# Altium schematic sheet 调焦器.SchDoc
size A4
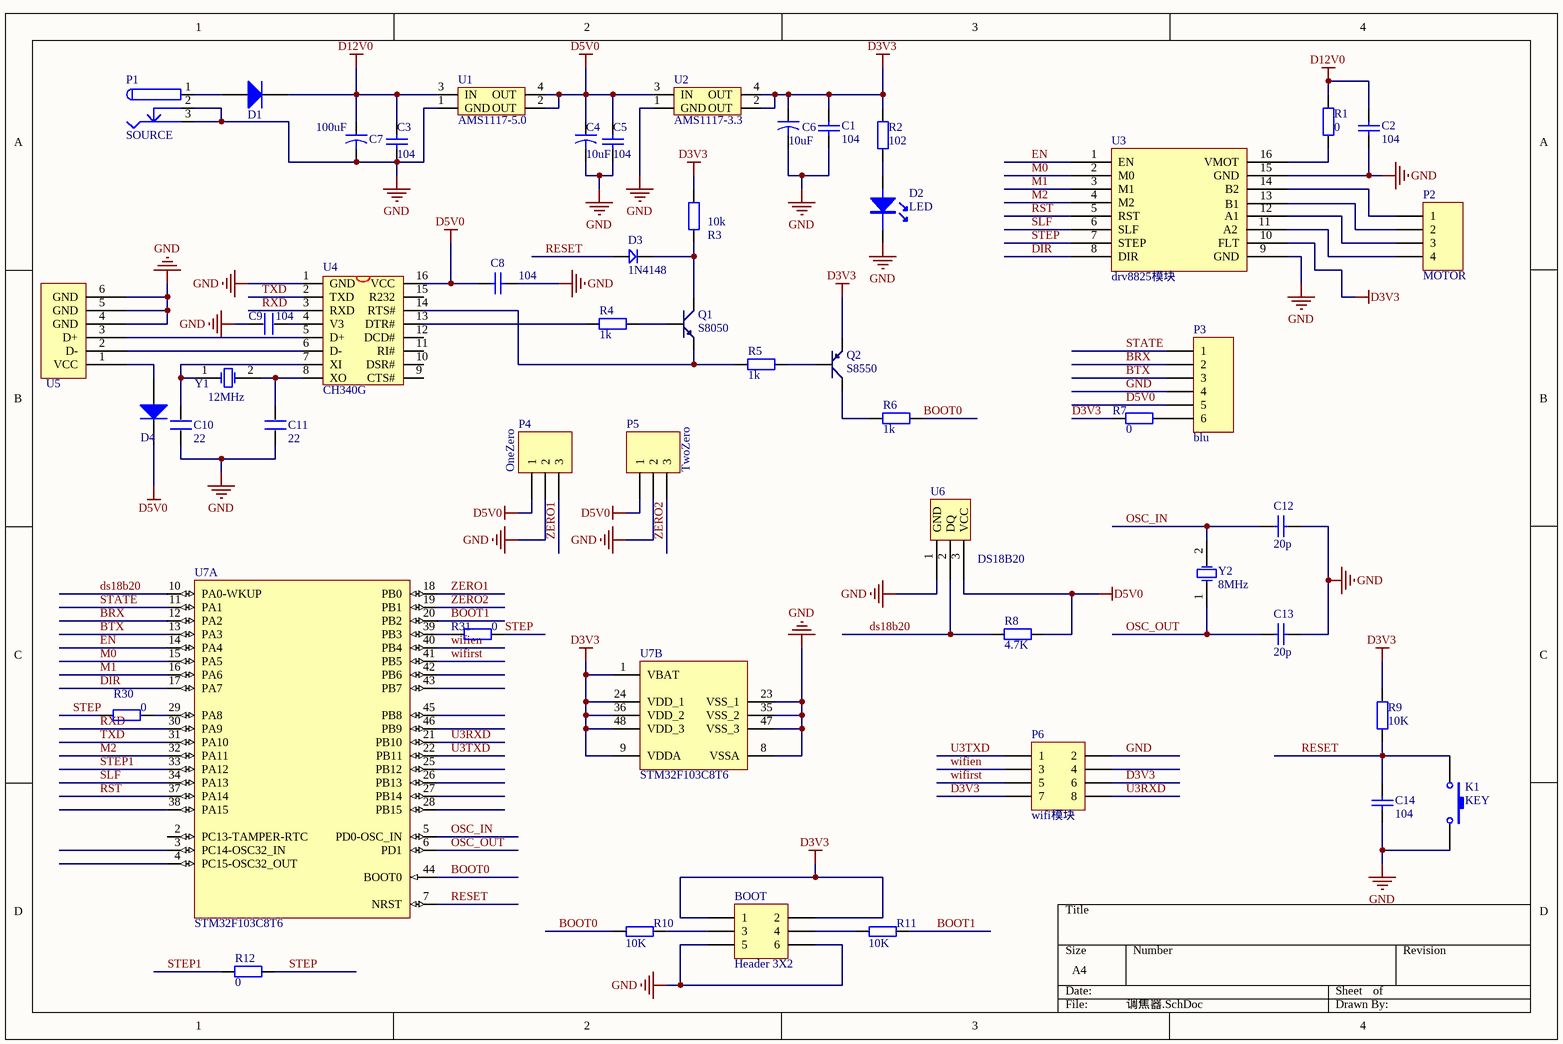
[diagram p0: 调焦器.SchDoc]

## Parts
BOOT  Header 3X2  [HDR2X3]
C1  value 104  [0805_cap]  (hidden comment: Cap)
C2  value 104  [0805_cap]  (hidden comment: Cap)
C3  value 104  [0805_cap]  (hidden comment: Cap)
C4  vaule: 10uF  [1812]  (hidden comment: CAP)
C5  value 104  [0805_cap]  (hidden comment: Cap)
C6  vaule: 10uF  [1812]  (hidden comment: CAP)
C7  vaule: 100uF  [1000UF/16V]  (hidden comment: CAP)
C8  value 104  [0805_cap]  (hidden comment: Cap)
C9  104  [0805]
C10  22  [0805]
C11  22  [0805]
C12  value 20p  [0805_cap]  (hidden comment: Cap)
C13  value 20p  [0805_cap]  (hidden comment: Cap)
C14  value 104  [0805_cap]  (hidden comment: Cap)
D1  Diode  [Diode]  (value not drawn)
D2  LED  [LED]
D3  1N4148  [Diode]
D4  Diode  [Diode]  (value not drawn)
K1  KEY  [KEY2]
P1  SOURCE  [source]
P2  MOTOR  [HDR1X4]
P3  blu  [HDR1X6]
P4  OneZero  [HDR1X3]
P5  TwoZero  [HDR1X3]
P6  wifi模块  [HDR2X4]
Q1  S8050  [SOT-23R]
Q2  S8550  [SOT-23R]
R1  0  [0805]
R2  102  [0805]
R3  10k  [0805]
R4  1k  [0805]
R5  1k  [0805]
R6  1k  [0805]
R7  0  [0805]
R8  4.7K  [0805]
R9  10K  [0805]
R10  10K  [0805]
R11  10K  [0805]
R12  0  [0805]
R30  0  [0805]
R31  0  [0805]
U1  AMS1117-5.0  [AMS1117]
U2  AMS1117-3.3  [AMS1117]
U3  drv8825模块  [DRV8825模块 - duplicate]
U4  CH340G  [SOP16M]
U5  USB-B  [USB_B]  (value not drawn)
U6  DS18B20  [DS18B20]
U7  STM32F103C8T6  [LQFP48_N]  (parts A,B of 2)
Y1  12MHz  [XTAL_US]
Y2  8MHz  [XTAL_US]

## Nets
D3V3: BOOT.1 BOOT.2 C1.2 C6.1 P6.6 P6.7 Q2.1(E) R2.2 R3.2 R7.1 R9.2 U2.2(OUT) U2.4(OUT) U3.10(FLT) U7.1(VBAT) U7.9(VDDA) U7.24(VDD_1) U7.36(VDD_2) U7.48(VDD_3)
D5V0: C4.1 C5.2 C8.2 D4.2(K) P3.5 P4.1 P5.1 R8.2 U1.2(OUT) U1.4(OUT) U2.3(IN) U4.16(VCC) U6.3(VCC)
D12V0: C2.2 C3.2 C7.1 D1.2(K) R1.2 U1.3(IN)
GND: BOOT.5 BOOT.6 C1.1 C2.1 C3.1 C4.2 C5.1 C6.2 C7.2 C8.1 C9.1 C10.1 C11.1 C12.2 C13.2 C14.1 D2.2(K) K1.2 P1.2 P1.3 P3.4 P4.2 P5.2 P6.2 U1.1(GND) U2.1(GND) U3.9(GND) U3.15(GND) U4.1(GND) U5.4(GND) U5.5(GND) U5.6(GND) U6.1(GND) U7.8(VSSA) U7.23(VSS_1) U7.35(VSS_2) U7.47(VSS_3)
BOOT0: R6.2 R10.1 U7.44(BOOT0)
BOOT1: R11.2 U7.20(PB2)
BRX: P3.2 U7.12(PA2)
BTX: P3.3 U7.13(PA3)
DIR: U3.8(DIR) U7.17(PA7)
ds18b20: R8.1 U6.2(DQ) U7.10(PA0-WKUP)
EN: U3.1(EN) U7.14(PA4)
M0: U3.2(M0) U7.15(PA5)
M1: U3.3(M1) U7.16(PA6)
M2: U3.4(M2) U7.32(PA11)
OSC_IN: C12.1 U7.5(PD0-OSC_IN) Y2.2(OSC2)
OSC_OUT: C13.1 U7.6(PD1) Y2.1(OSC1)
RESET: C14.2 D3.1 K1.1 R9.1 U7.7(NRST)
RST: U3.5(RST) U7.37(PA14)
RXD: U4.3(RXD) U7.30(PA9)
SLF: U3.6(SLF) U7.34(PA13)
STATE: P3.1 U7.11(PA1)
STEP: R12.2 R30.1 R31.2 U3.7(STEP)
STEP1: R12.1 U7.33(PA12)
TXD: U4.2(TXD) U7.31(PA10)
U3RXD: P6.8 U7.21(PB10)
U3TXD: P6.1 U7.22(PB11)
wifien: P6.3 U7.40(PB4)
wifirst: P6.5 U7.41(PB5)
ZERO1: P4.3 U7.18(PB0)
ZERO2: P5.3 U7.19(PB1)
NetBOOT_3: BOOT.3 R10.2
NetBOOT_4: BOOT.4 R11.1
NetC9_2: C9.2 U4.4(V3)
NetC10_2: C10.2 U4.7(XI) Y1.1(OSC1)
NetC11_2: C11.2 U4.8(XO) Y1.2(OSC2)
NetD1_1: D1.1(A) P1.1
NetD2_1: D2.1(A) R2.1
NetD3_2: D3.2 Q1.3(C) R3.1
NetD4_1: D4.1(A) U5.1(VCC)
NetP2_1: P2.1 U3.14(B2)
NetP2_2: P2.2 U3.13(B1)
NetP2_3: P2.3 U3.12(A1)
NetP2_4: P2.4 U3.11(A2)
NetP3_6: P3.6 R7.2
NetQ1_1: Q1.1(E) R5.1 U4.14(RTS#)
NetQ1_2: Q1.2(B) R4.2
NetQ2_2: Q2.2(B) R5.2
NetQ2_3: Q2.3(C) R6.1
NetR1_1: R1.1 U3.16(VMOT)
NetR4_1: R4.1 U4.13(DTR#)
NetR30_2: R30.2 U7.29(PA8)
NetR31_1: R31.1 U7.39(PB3)
NetU4_5: U4.5(D+) U5.3(D+)
NetU4_6: U4.6(D-) U5.2(D-)

Not connected (* = marked no-connect by the designer): P6 4; U4 9(CTS#) 10(DSR#) 11(RI#) 12(DCD#) 15(R232); U7 2(PC13-TAMPER-RTC) 3(PC14-OSC32_IN) 4(PC15-OSC32_OUT) 25(PB12) 26(PB13) 27(PB14) 28(PB15) 38(PA15) 42(PB6) 43(PB7) 45(PB8) 46(PB9)

## Library data of the parts
BOOT = Header 3X2: Header, 3-Pin, Dual row; LatestRevisionDate: 17-Jul-2002; LatestRevisionNote: Re-released for DXP Platform.; Publisher: Altium Limited
C1-C3 C5 C8 C12-C14 = Cap: Capacitor; Published: 8-Jun-2000; LatestRevisionDate: 17-Jul-2002; LatestRevisionNote: Re-released for DXP Platform.; PackageReference: RAD-0.3; Publisher: Altium Limited
C4 C6 C7 = CAP2
C9-C11 = C
D1 D4 = Diode: High Conductance Fast Diode; Published: 8-Jun-2000; LatestRevisionDate: 17-Jul-2002; LatestRevisionNote: Re-released for DXP Platform.; DatasheetDocument: 1997; PackageReference: DO-35; Publisher: Altium Limited; Code_JEDEC: DO-204-AH; ComponentLink1Description: Manufacturer Link; ComponentLink1URL: http://www.fairchildsemi.com/; ComponentLink2Description: Datasheet; ComponentLink2URL: http://www.fairchildsemi.com/ds/1N%2F1N4448.pdf
D2 = LED: LED 发光二极管
D3 = D
K1 = KEY2: Switch; Published: 24-Mar-1999; LatestRevisionDate: 17-Jul-2002; LatestRevisionNote: Re-released for DXP Platform.; PackageReference: SPST-2; Publisher: Altium Limited
P2 = Header 4: Header, 4-Pin; LatestRevisionDate: 17-Jul-2002; LatestRevisionNote: Re-released for DXP Platform.; Publisher: Altium Limited
P3 = Header 6: Header, 6-Pin; LatestRevisionDate: 17-Jul-2002; LatestRevisionNote: Re-released for DXP Platform.; Publisher: Altium Limited
P4 P5 = Header 3: Header, 3-Pin; LatestRevisionDate: 17-Jul-2002; LatestRevisionNote: Re-released for DXP Platform.; Publisher: Altium Limited
P6 = Header 4X2: Header, 4-Pin, Dual row; LatestRevisionDate: 17-Jul-2002; LatestRevisionNote: Re-released for DXP Platform.; Publisher: Altium Limited
Q1 = NPN: 8050/BCW846/BCW847
Q2 = PNP: 8550/BCW68
R1-R3 R7-R9 R12 R30 R31 = RES: Resistor; Value: 1K; Published: 8-Jun-2000; Revision: July-2002: Re-released for DXP Platform.; Publisher: Altium Limited
R4-R6 = RES: Resistor; Published: 8-Jun-2000; Revision: July-2002: Re-released for DXP Platform.; Publisher: Altium Limited; Value: 1K
R10 R11 = R
U1 U2 = AMS1117
U4 = CH340G: USB2UART
U7 = STM32F103C8T6: STM32 ARM-based 32-bit MCU Performance Line with 64 kB Flash, 20 kB Internal RAM, -40 to +85°C Temperature, 48-Pin LQFP, Tray; DatasheetVersion: rev13.0, Apr-2011; PackageVersion: rev13, Apr-2011; PackageReference: LQFP48; PackageDescription: 48-Pin Low-Profile Quad Flat Pack, 7 x 7 mm Body, 0.5 mm Pitch (LQFP48); ComponentLink1Description: Manufacturer URL; ComponentLink1URL: http://www.st.com/; ComponentLink2Description: STM32F103 Datasheet; ComponentLink2URL: http://www.st.com/internet/com/TECHNICAL_RESOURCES/TECHNICAL_LITERATURE/DATASHEET/CD00161566.pdf; ComponentLink3Description: STM32 Family Web Page; ComponentLink3URL: www.st.com/stm32
Y1 Y2 = XTAL: Crystal Oscillator; Published: 8-Jun-2000; LatestRevisionDate: 17-Jul-2002; LatestRevisionNote: Re-released for DXP Platform.; Publisher: Altium Limited
P1 = SOURCE: LatestRevisionDate: 17-Jul-2002; LatestRevisionNote: Re-released for DXP Platform.; Publisher: Altium Limited